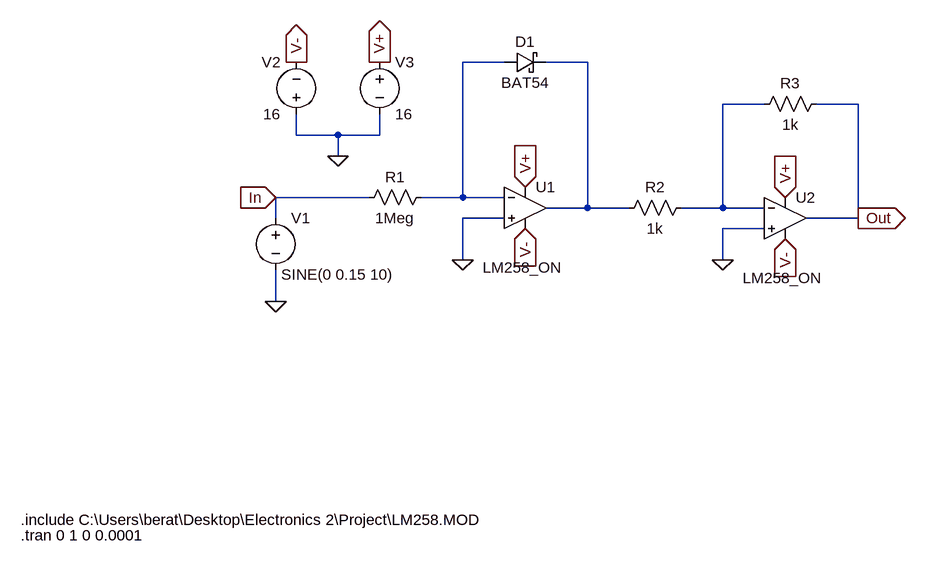
[diagram p0: schematic logOpamp.asc]
logOpamp.asc, the LTspice schematic file:
Version 4
SHEET 1 880 680
WIRE 112 -80 48 -80
WIRE 240 -80 176 -80
WIRE 512 -16 448 -16
WIRE 656 -16 592 -16
WIRE -208 32 -208 0
WIRE -144 32 -208 32
WIRE -80 32 -80 0
WIRE -80 32 -144 32
WIRE -144 64 -144 32
WIRE -96 128 -240 128
WIRE 48 128 48 -80
WIRE 48 128 -16 128
WIRE 112 128 48 128
WIRE 240 144 240 -80
WIRE 240 144 176 144
WIRE 304 144 240 144
WIRE 448 144 448 -16
WIRE 448 144 384 144
WIRE 512 144 448 144
WIRE -240 160 -240 128
WIRE 112 160 48 160
WIRE 656 160 656 -16
WIRE 656 160 576 160
WIRE 512 176 448 176
WIRE 48 224 48 160
WIRE 448 224 448 176
WIRE -240 288 -240 240
FLAG 48 224 0
FLAG -240 288 0
FLAG -144 64 0
FLAG -240 128 In
IOPIN -240 128 In
FLAG -80 -80 V+
IOPIN -80 -80 Out
FLAG -208 -80 V-
IOPIN -208 -80 Out
FLAG 144 112 V+
IOPIN 144 112 In
FLAG 144 176 V-
IOPIN 144 176 In
FLAG 544 128 V+
IOPIN 544 128 In
FLAG 544 192 V-
IOPIN 544 192 In
FLAG 448 224 0
FLAG 656 160 Out
IOPIN 656 160 Out
SYMBOL OpAmps\\opamp2 144 80 R0
WINDOW 3 -65 156 Left 2
SYMATTR Value LM258_ON
SYMATTR InstName U1
SYMBOL res 0 112 R90
WINDOW 0 0 56 VBottom 2
WINDOW 3 32 56 VTop 2
SYMATTR InstName R1
SYMATTR Value 1Meg
SYMBOL voltage -240 144 R0
WINDOW 123 24 124 Left 2
WINDOW 39 0 0 Left 0
WINDOW 3 9 103 Left 2
SYMATTR Value SINE(0 0.15 10)
SYMATTR InstName V1
SYMBOL voltage -208 16 R180
WINDOW 0 24 96 Left 2
WINDOW 3 24 16 Left 2
WINDOW 123 0 0 Left 0
WINDOW 39 0 0 Left 0
SYMATTR InstName V2
SYMATTR Value 16
SYMBOL voltage -80 -96 R0
WINDOW 123 0 0 Left 0
WINDOW 39 0 0 Left 0
SYMATTR InstName V3
SYMATTR Value 16
SYMBOL schottky 112 -64 R270
WINDOW 0 32 32 VTop 2
WINDOW 3 0 32 VBottom 2
SYMATTR InstName D1
SYMATTR Value BAT54
SYMATTR Description Diode
SYMATTR Type diode
SYMBOL OpAmps\\opamp2 544 96 R0
WINDOW 3 -65 156 Left 2
SYMATTR Value LM258_ON
SYMATTR InstName U2
SYMBOL res 400 128 R90
WINDOW 0 0 56 VBottom 2
WINDOW 3 32 56 VTop 2
SYMATTR InstName R2
SYMATTR Value 1k
SYMBOL res 608 -32 R90
WINDOW 0 0 56 VBottom 2
WINDOW 3 32 56 VTop 2
SYMATTR InstName R3
SYMATTR Value 1k
TEXT -632 624 Left 2 !.include C:\\Users\\berat\\Desktop\\Electronics 2\\Project\\LM258.MOD
TEXT -632 648 Left 2 !.tran 0 1 0 0.0001

The netlist it stands for:
* logOpamp.asc
XU1 0 N001 V+ V- N002 LM258_ON  ; pins In+ In- V+ V- OUT
R1 N001 In 1Meg
V1 In 0 SINE(0 0.15 10)
V2 0 V- 16
V3 V+ 0 16
D1 N001 N002 BAT54
XU2 0 N003 V+ V- Out LM258_ON  ; pins In+ In- V+ V- OUT
R2 N003 N002 1k
R3 Out N003 1k
.model D D
.lib standard.dio
.include C:\Users\berat\Desktop\Electronics 2\Project\LM258.MOD
.tran 0 1 0 0.0001
.backanno
.end